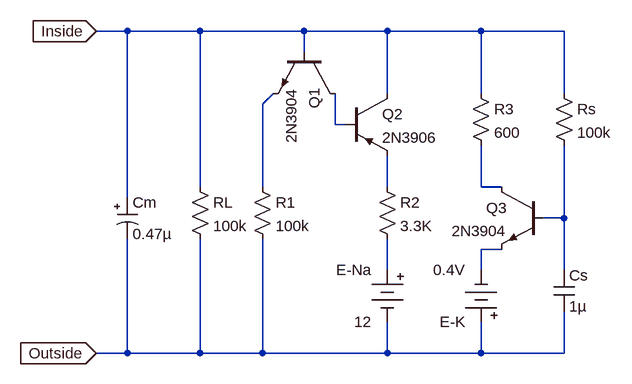
[diagram p0: schematic Unidad-FHN.asc]
Unidad-FHN.asc, the LTspice schematic file:
Version 4
SHEET 1 1332 680
WIRE -368 -96 -416 -96
WIRE -256 -96 -368 -96
WIRE -96 -96 -256 -96
WIRE 32 -96 -96 -96
WIRE 176 -96 32 -96
WIRE 304 -96 176 -96
WIRE -96 -64 -96 -96
WIRE 32 0 32 -96
WIRE 176 0 176 -96
WIRE 304 0 304 -96
WIRE -160 16 -144 0
WIRE -48 48 -48 0
WIRE -32 48 -48 48
WIRE -256 144 -256 -96
WIRE -160 144 -160 16
WIRE 32 144 32 96
WIRE 176 144 176 80
WIRE 208 144 176 144
WIRE -368 160 -368 -96
WIRE 304 192 304 80
WIRE 304 192 272 192
WIRE 208 240 176 240
WIRE 32 272 32 224
WIRE 176 272 176 240
WIRE 304 272 304 192
WIRE -368 400 -368 224
WIRE -368 400 -416 400
WIRE -256 400 -256 224
WIRE -256 400 -368 400
WIRE -160 400 -160 224
WIRE -160 400 -256 400
WIRE 32 400 32 352
WIRE 32 400 -160 400
WIRE 176 400 176 352
WIRE 176 400 32 400
WIRE 304 400 304 336
WIRE 304 400 176 400
FLAG -416 -96 Inside
IOPIN -416 -96 In
FLAG -416 400 Outside
IOPIN -416 400 In
SYMBOL res -272 128 R0
SYMATTR InstName RL
SYMATTR Value 100k
SYMBOL res -176 128 R0
SYMATTR InstName R1
SYMATTR Value 100k
SYMBOL res 288 -16 R0
SYMATTR InstName Rs
SYMATTR Value 100k
SYMBOL cap 288 272 R0
SYMATTR InstName Cs
SYMATTR Value 1µ
SYMBOL npn -48 -64 R90
SYMATTR InstName Q1
SYMATTR Value 2N3904
SYMBOL pnp -32 0 R0
SYMATTR InstName Q2
SYMATTR Value 2N3906
SYMBOL Misc\\battery 32 256 M0
WINDOW 123 0 0 Left 0
WINDOW 39 0 0 Left 0
SYMATTR InstName E-Na
SYMATTR Value 12
SYMBOL npn 272 144 M0
SYMATTR InstName Q3
SYMATTR Value 2N3904
SYMBOL res 16 128 R0
SYMATTR InstName R2
SYMATTR Value 3.3K
SYMBOL polcap -384 160 R0
SYMATTR InstName Cm
SYMATTR Value 0.47µ
SYMBOL res 160 -16 R0
SYMATTR InstName R3
SYMATTR Value 600
SYMBOL Misc\\battery 176 368 R180
WINDOW 123 0 0 Left 0
WINDOW 39 0 0 Left 0
SYMATTR InstName E-K
SYMATTR Value 0.4V

The netlist it stands for:
* Unidad-FHN.asc
RL Inside Outside 100k
R1 N001 Outside 100k
Rs Inside N005 100k
Cs N005 Outside 1µ
Q1 N002 Inside N001 0 2N3904
Q2 Inside N002 N003 0 2N3906
V§E-Na N007 Outside 12
Q3 N004 N005 N006 0 2N3904
R2 N003 N007 3.3K
Cm Inside Outside 0.47µ
R3 Inside N004 600
V§E-K Outside N006 0.4V
.model NPN NPN
.model PNP PNP
.lib standard.bjt
.backanno
.end